# Altium project 直流稳压电源.PrjPcb
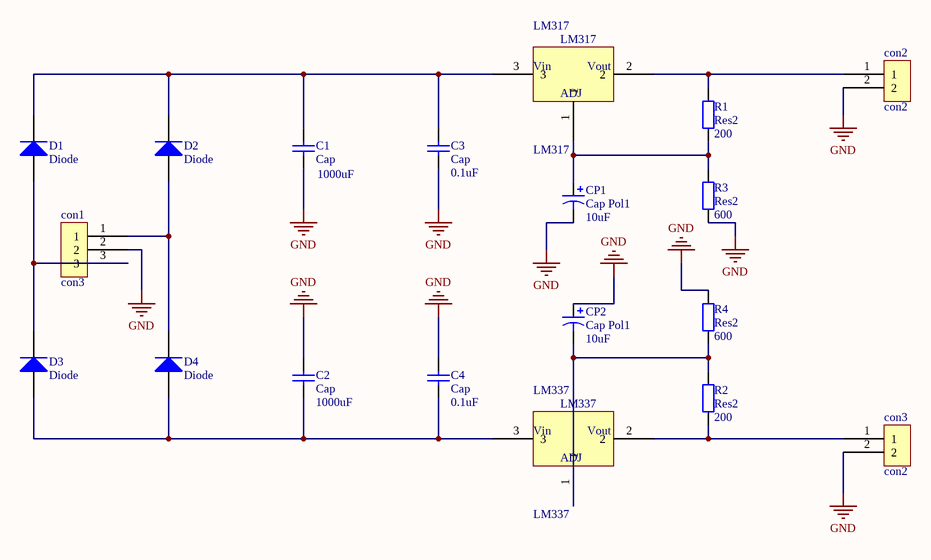
[diagram p0: Sheet1.SchDoc]
1 sheet, 19 parts. Net scope: global (net labels, ports and power ports of the same name join across sheets).
Board files: PCB1.PcbDoc, PCB2.PcbDoc

## Sheet Sheet1.SchDoc
size A4

### Parts
C1  Cap  value 1000uF  [RAD-0.3]
C2  Cap  value 1000uF  [RAD-0.3]
C3  Cap  value 0.1uF  [RAD-0.3]
C4  Cap  value 0.1uF  [RAD-0.3]
con1  con3  [con3]
con2  con2  [con2]
con3  con2  [con2]
CP1  Cap Pol1  value 10uF  [RB7.6-15]
CP2  Cap Pol1  value 10uF  [RB7.6-15]
D1  Diode  [DIODE-0.4]
D2  Diode  [DIODE-0.4]
D3  Diode  [DIODE-0.4]
D4  Diode  [DIODE-0.4]
LM317  LM317  [TO-220-AB]
LM337  LM337  [TO-220-AB]
R1  Res2  value 200  [AXIAL-0.4]
R2  Res2  value 200  [AXIAL-0.4]
R3  Res2  value 600  [AXIAL-0.4]
R4  Res2  value 600  [AXIAL-0.4]

### Nets
GND: C1.1 C2.2 C3.1 C4.2 con1.2 con2.2 con3.2 CP1.2 CP2.1 R3.1 R4.2
NetC1_2: C1.2 C3.2 D1.2(K) D2.2(K) LM317.3
NetC2_1: C2.1 C4.1 D3.1(A) D4.1(A) LM337.3
Netcon1_1: con1.1 D2.1(A) D4.2(K)
Netcon1_3: con1.3 D1.1(A) D3.2(K)
Netcon2_1: con2.1 LM317.2 R1.2
Netcon3_1: con3.1 LM337.2 R2.1
NetCP1_1: CP1.1 LM317.1 R1.1 R3.2
NetCP2_2: CP2.2 LM337.1 R2.2 R4.1

### Notes on the sheet
- (in symbol LM317) Vin; Vout; ADJ
- (in symbol LM337) Vin; Vout; ADJ

### Library data of the parts
C1-C4 = Cap: Capacitor; Published: 8-Jun-2000; LatestRevisionDate: 17-Jul-2002; LatestRevisionNote: Re-released for DXP Platform.; PackageReference: RAD-0.3; Publisher: Altium Limited; PackageDescription: Radial Cap, Thru-Hole; 2 Leads; 0.3 in Pin Spacing
CP1 CP2 = Cap Pol1: Polarized Capacitor (Radial); Published: 8-Jun-2000; LatestRevisionDate: 17-Jul-2002; LatestRevisionNote: Re-released for DXP Platform.; PackageReference: RB7.6-15; Publisher: Altium Limited; PackageDescription: Polarized Capacitor (Radial); 2 Leads
D1-D4 = Diode: Default Diode; Published: 8-Jun-2000; LatestRevisionDate: 17-Jul-2002; LatestRevisionNote: Re-released for DXP Platform.; PackageVersion: Sep-1996; PackageReference: SMC; Publisher: Altium Limited; PackageDescription: DO-214-AB/SMC; 2 C-Bend Leads; Body 7.9 x 5.9 mm, inc. leads (LxW); Code_JEDEC: DO-214-AB
R1-R4 = Res2: Resistor; Published: 8-Jun-2000; LatestRevisionDate: 17-Jul-2002; LatestRevisionNote: Re-released for DXP Platform.; PackageReference: AXIAL-0.4; Publisher: Altium Limited; PackageDescription: Axial Device, Thru-Hole; 2 Leads; 0.4 in Pin Spacing